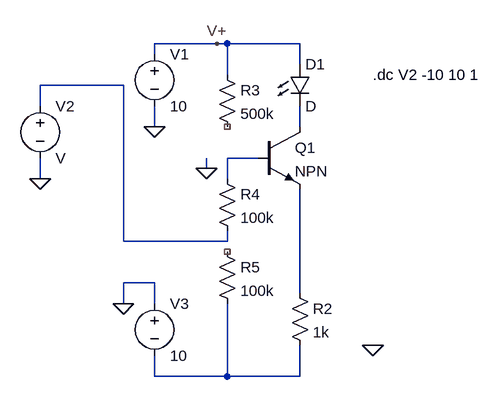
[diagram p0: schematic led.asc]
led.asc, the LTspice schematic file:
Version 4
SHEET 1 880 680
WIRE 352 96 256 96
WIRE 368 96 352 96
WIRE 480 96 368 96
WIRE 256 112 256 96
WIRE 480 128 480 96
WIRE 368 144 368 96
WIRE 208 160 80 160
WIRE 80 192 80 160
WIRE 256 224 256 192
WIRE 480 224 480 192
WIRE 416 272 368 272
WIRE 336 288 336 272
WIRE 80 304 80 272
WIRE 368 304 368 272
WIRE 208 400 208 160
WIRE 368 400 368 384
WIRE 368 400 208 400
WIRE 256 464 208 464
WIRE 480 480 480 320
WIRE 208 496 208 464
WIRE 256 496 256 464
WIRE 256 608 256 576
WIRE 368 608 368 496
WIRE 368 608 256 608
WIRE 480 608 480 560
WIRE 480 608 368 608
FLAG 336 288 0
FLAG 592 560 0
FLAG 256 224 0
FLAG 80 304 0
FLAG 352 96 V+
FLAG 208 496 0
SYMBOL npn 416 224 R0
SYMATTR InstName Q1
SYMBOL res 464 464 R0
SYMATTR InstName R2
SYMATTR Value 1k
SYMBOL LED 464 128 R0
SYMATTR InstName D1
SYMBOL voltage 256 96 R0
SYMATTR InstName V1
SYMATTR Value 10
SYMBOL voltage 80 176 R0
SYMATTR InstName V2
SYMBOL res 352 128 R0
SYMATTR InstName R3
SYMATTR Value 500k
SYMBOL res 352 288 R0
SYMATTR InstName R4
SYMATTR Value 100k
SYMBOL voltage 256 480 R0
SYMATTR InstName V3
SYMATTR Value 10
SYMBOL res 352 400 R0
SYMATTR InstName R5
SYMATTR Value 100k
TEXT 592 144 Left 2 !.dc V2 -10 10 1

The netlist it stands for:
* led.asc
Q1 N002 N003 N004 0 NPN
R2 N004 N005 1k
D1 V+ N002 D
V1 V+ 0 10
V2 N001 0 V
R3 V+ NC_01 500k
R4 N003 N001 100k
V3 0 N005 10
R5 NC_02 N005 100k
.model D D
.lib standard.dio
.model NPN NPN
.model PNP PNP
.lib standard.bjt
.dc V2 -10 10 1
.backanno
.end